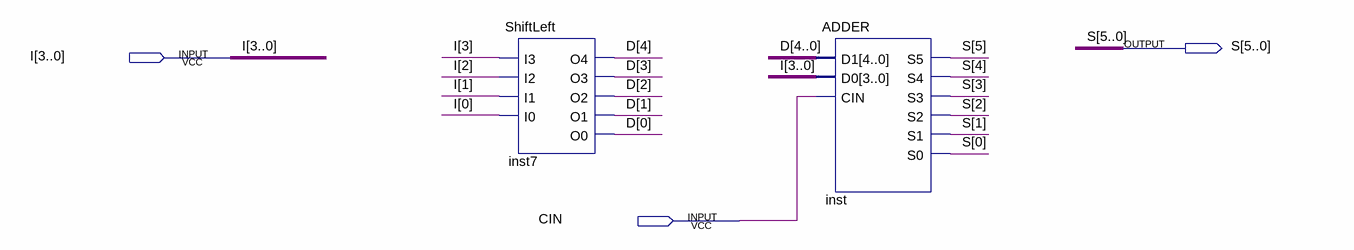
[diagram p0: schematic sheet]
// Quartus schematic Multiply_by_3.bdf as structural Verilog: 2 symbols, 3 pins
module Multiply_by_3 (
  input  [3:0] I,
  input  CIN,
  output [5:0] S
);

  wire [4:0] D;

  ShiftLeft inst7 (.I3(I[3]), .I2(I[2]), .I1(I[1]), .I0(I[0]), .O4(D[4]), .O3(D[3]), .O2(D[2]), .O1(D[1]), .O0(D[0]));
  ADDER inst (.D1(D), .D0(I), .CIN(CIN), .S5(S[5]), .S0(S[0]), .S1(S[1]), .S2(S[2]), .S3(S[3]), .S4(S[4]));
endmodule
